# Altium schematic sheet Interface.SchDoc
size A4; SheetNumber: 4; SheetTotal: 5
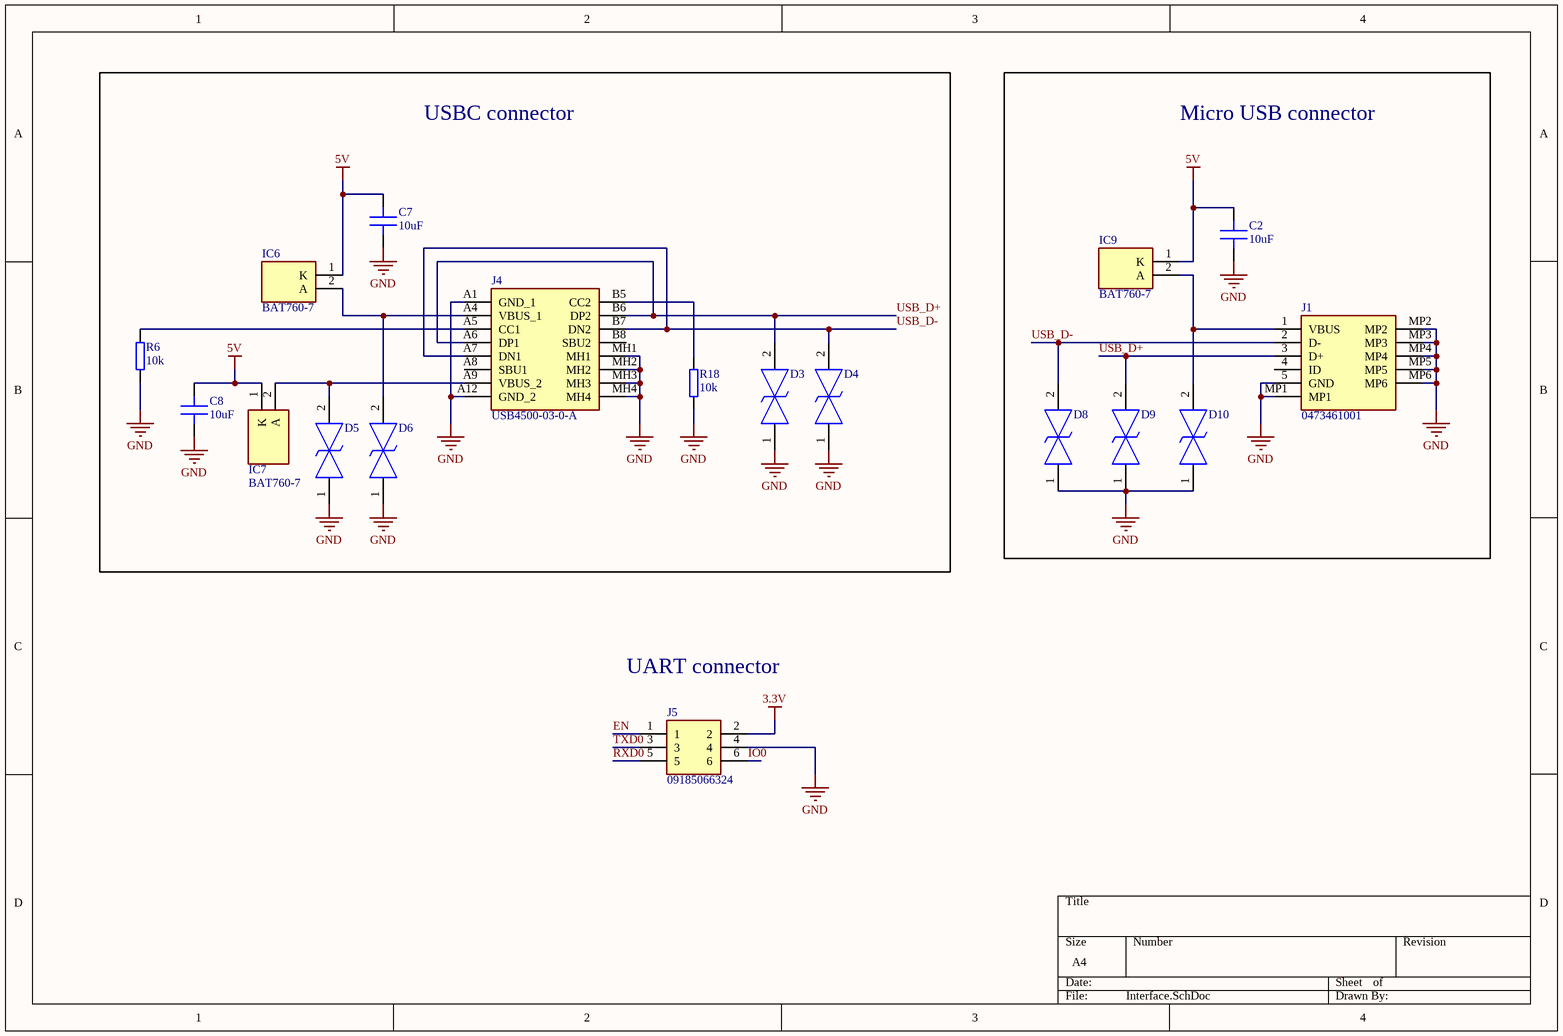
[diagram p0: Interface.SchDoc]

## Parts
C2  10uF  [C 0402]
C7  10uF  [C 0402]
C8  10uF  [C 0402]
D3  LESD5D5.0CT1G  [LESD5D50CT1G]  (value not drawn)
D4  LESD5D5.0CT1G  [LESD5D50CT1G]  (value not drawn)
D5  LESD5D5.0CT1G  [LESD5D50CT1G]  (value not drawn)
D6  LESD5D5.0CT1G  [LESD5D50CT1G]  (value not drawn)
D8  LESD5D5.0CT1G  [LESD5D50CT1G]  (value not drawn)
D9  LESD5D5.0CT1G  [LESD5D50CT1G]  (value not drawn)
D10  LESD5D5.0CT1G  [LESD5D50CT1G]  (value not drawn)
IC6  BAT760-7  [SOD2513X120N]
IC7  BAT760-7  [SOD2513X120N]
IC9  BAT760-7  [SOD2513X120N]
J1  0473461001  [0473461001]
J4  USB4500-03-0-A  [USB4500030A]
J5  09185066324  [09185066324]
R6  10k  [R 0402]
R18  10k  [R 0402]

## Blocks framed on the sheet
USBC connector: C7 C8 D3-D6 IC6 IC7 J4 R6 R18
Micro USB connector: C2 D8-D10 IC9 J1

## Nets
3.3V: J5.2
5V: C2.1 C7.1 C8.1 IC6.1(K) IC7.1(K) IC9.1(K)
GND: C2.2 C7.2 C8.2 D3.1 D4.1 D5.1 D6.1 D8.1 D9.1 D10.1 J1.5(GND) J1.MP1 J1.MP2 J1.MP3 J1.MP4 J1.MP5 J1.MP6 J4.A1(GND_1) J4.A12(GND_2) J4.MH1 J4.MH2 J4.MH3 J4.MH4 J5.4 R6.1 R18.1
EN: J5.1
IO0: J5.6
RXD0: J5.5
TXD0: J5.3
USB_D+: D3.2 D9.2 J1.3(D+) J4.A6(DP1) J4.B6(DP2)
USB_D-: D4.2 D8.2 J1.2(D-) J4.A7(DN1) J4.B7(DN2)
NetD5_2: D5.2 IC7.2(A) J4.A9(VBUS_2)
NetD6_2: D6.2 IC6.2(A) J4.A4(VBUS_1)
NetD10_2: D10.2 IC9.2(A) J1.1(VBUS)
NetJ4_A5: J4.A5(CC1) R6.2
NetJ4_B5: J4.B5(CC2) R18.2

Not connected (* = marked no-connect by the designer): J1 4(ID); J4 A8(SBU1) B8(SBU2)

## Notes on the sheet
- UART connector

## Library data of the parts
C2 C7 C8 = Capacitor: MLCC Capacitor
D3-D6 D8-D10 = LESD5D5.0CT1G: TVS Diode (Bi-directional); Manufacturer_Name: LRC; Height: 0.7mm; Manufacturer_Part_Number: LESD5D5.0CT1G
IC6 IC7 IC9 = BAT760-7: Integrated Circuit; Manufacturer_Name: Lattice Semiconductor; Datasheet Link: https://www.diodes.com/assets/Datasheets/ds30498.pdf; Height: 1.2mm; Manufacturer_Part_Number: BAT760-7; Mouser Part Number: N/A; Mouser Price/Stock: https://www.mouser.com/Search/Refine.aspx?Keyword=N%2FA
J1 = 0473461001: Connector; Manufacturer_Name: Molex; Datasheet Link: https://componentsearchengine.com/Datasheets/1/0473461001.pdf; Height: 2.45mm; Manufacturer_Part_Number: 0473461001; Mouser Part Number: N/A; Mouser Price/Stock: https://www.mouser.co.uk/ProductDetail/Molex/0473461001?qs=2bnkQPT%252BPafTZgGVt%2FOGfA%3D%3D; Arrow Part Number: 0473461001; Arrow Price/Stock: https://www.arrow.com/en/products/0473461001/molex?region=nac
J4 = USB4500-03-0-A: Connector; Manufacturer_Name: GCT (GLOBAL CONNECTOR TECHNOLOGY); Datasheet Link: https://componentsearchengine.com/Datasheets/2/USB4500-03-0-A.pdf; Manufacturer_Part_Number: USB4500-03-0-A; Mouser Part Number: 640-USB4500030A; Mouser Price/Stock: https://www.mouser.co.uk/ProductDetail/GCT/USB4500-03-0-A?qs=7D1LtPJG0i2mVyw7UtV%2FkQ%3D%3D
J5 = 09185066324: Connector; Manufacturer_Name: HARTING; Datasheet Link: https://b2b.harting.com/files/download/PRD/PDF_DS/PDF_DS_09185066324_EN.pdf; Manufacturer_Part_Number: 09185066324; Mouser Part Number: 617-09185066324; Mouser Price/Stock: https://www.mouser.co.uk/ProductDetail/HARTING/09185066324?qs=qa49y27LPCE%2F3ZplMsKEeQ%3D%3D; Arrow Part Number: 09185066324; Arrow Price/Stock: https://www.arrow.com/en/products/09185066324/harting?utm_currency=USD&region=europe
R6 R18 = Resistor: General pourpouse resistor